# Altium project CU100_V1.0.PrjPCB
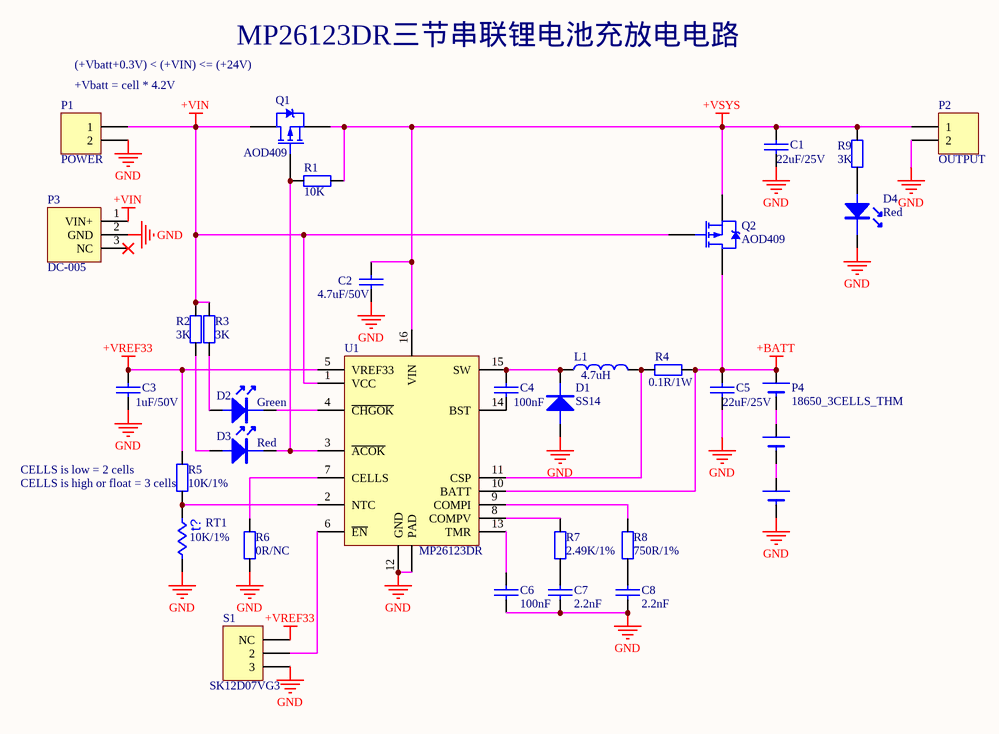
[diagram p0: CU100_V1.0.SchDoc]
1 sheet, 31 parts. Net scope: global (net labels, ports and power ports of the same name join across sheets).
Board files: CU100_V1.0.PcbDoc, CU100_Weld_V1.0.PcbDoc

## Sheet CU100_V1.0.SchDoc
size A4

### Parts
C1  22uF/25V  [1210_C]
C2  4.7uF/50V  [1206_C]
C3  1uF/50V  [0603_CN]
C4  100nF  [0603_CN]
C5  22uF/25V  [1210_C]
C6  100nF  [0603_CN]
C7  2.2nF  [0603_CN]
C8  2.2nF  [0603_CN]
D1  SS14  [DO-214AC(SMA)]
D2  Green  [0603_LED]
D3  Red  [0603_LED]
D4  Red  [0603_LED]
L1  4.7uH  [CDRH104]
P1  POWER  [KF5.08-2P]
P2  OUTPUT  [KF5.08-2P]
P3  DC-005  [DC-5.5-2.1mm]
P4  18650_3CELLS_THM  [18650_3CELLS_THM]
Q1  AOD409  [TO-252]
Q2  AOD409  [TO-252]
R1  10K  [0603_RN]
R2  3K  [0603_RN]
R3  3K  [0603_RN]
R4  0.1R/1W  [2512_R]
R5  10K/1%  [0603_RN]
R6  0R/NC  [0603_RN]
R7  2.49K/1%  [0603_RN]
R8  750R/1%  [0603_RN]
R9  3K  [0603_RN]
RT1  10K/1%  [RT3950K]
S1  SK12D07VG3  [SK12D07VG3]
U1  MP26123DR  [QFN16(4X4)]

### Nets
+BATT: C5.1 P4.1(+) Q2.2(D) R4.2 U1.10(BATT)
+VIN: P1.1 P3.1(VIN+) Q1.2(D) Q2.1(G) R2.1 R3.2 U1.1(VCC)
+VREF33: C3.1 R5.2 S1.1(NC) U1.5(VREF33)
+VSYS: C1.1 C2.1 P2.1 Q1.3(S) Q2.3(S) R1.2 R9.1 U1.16(VIN)
GND: C1.2 C2.2 C3.2 C5.2 C6.2 C7.2 C8.2 D1.A D4.K P1.2 P2.2 P3.2(GND) P4.6(-) R6.1 RT1.2 S1.3 U1.12(GND) U1.PAD
NetC4_1: C4.1 D1.K L1.1 U1.15(SW)
NetC4_2: C4.2 U1.14(BST)
NetC6_1: C6.1 U1.13(TMR)
NetC7_1: C7.1 R7.1
NetC8_1: C8.1 R8.1
NetD2_A: D2.A R3.1
NetD2_K: D2.K U1.4(~{CHGOK})
NetD3_A: D3.A R2.2
NetD3_K: D3.K Q1.1(G) R1.1 U1.3(~{ACOK})
NetD4_A: D4.A R9.2
NetL1_2: L1.2 R4.1 U1.11(CSP)
NetP4_2: P4.2(-) P4.3(+)
NetP4_4: P4.4(-) P4.5(+)
NetR5_1: R5.1 RT1.1 U1.2(NTC)
NetR6_2: R6.2 U1.7(CELLS)
NetR7_2: R7.2 U1.8(COMPV)
NetR8_2: R8.2 U1.9(COMPI)
NetS1_2: S1.2 U1.6(~{EN})

Not connected (* = marked no-connect by the designer): P3 3(NC)*

### Notes on the sheet
- MP26123DR三节串联锂电池充放电电路
- (+Vbatt+0.3V) < (+VIN) <= (+24V)
- (near P1) +Vbatt = cell * 4.2V
- (near R5) CELLS is low = 2 cells
- (near R5) CELLS is high or float = 3 cells
- (in symbol RT) t?

### Library data of the parts
C1-C8 = Cap1
D1 = Diode-A: SS14,SS24,SS34,M7
D2-D4 = LED
L1 = Inductor: LQH1206: L=3.2mm,W=1.6mm,H=1.8mm; LQH2220: L=5.7mm,W=5mm,H=4.7mm; LQH1812: L=4.5mm,W=3.2mm,H=2.6mm; LQH1210: L=3.2mm,W=2.5mm,H=2mm; SMD1054: L=10mm,W=9mm,H=5.4mm; SMD5845: L=5.8mm,W=5.2mm,H=4.5mm; SMD7850: L=7.8mm,W=7mm,H=5mm; SMD1040: L=10mm,W=9mm,H=4mm; CDRH104: L=10mm,W=10mm,H=4.2mm; CDRH127: L=12mm,W=12mm,H=8mm; CDRH124: L=12mm,W=12mm,H=5mm; SMD7835: L=7.8mm,W=7mm,H=3.5mm; SMD3521: L=3.5mm,W=3.1mm,H=2.1mm; SMD4532: L=4.5mm,W=4mm,H=3.2mm; CDRH125: L=12mm,W=12mm,H=6.2mm; Inductance-8*10: D=8mm,H=10mm; Inductance-6*8: D=6mm,H=8mm; 0402_L: *; 1206_L: *; 0603_L: *; 1210_L: *; 0805_L: *
P1 P2 = Header 2: Header, 2-Pin; LatestRevisionDate: 17-Jul-2002; LatestRevisionNote: Re-released for DXP Platform.; Publisher: Altium Limited
R1-R9 = Res1: Name: Resistor; Power: 0210(1/20W 25V), 0402(1/16W  50V),0603(1/16W  50V),0805(1/10W  150V),1206(1/8W  200V),1210(1/4W  200V),1812(1/2W  200V),2010(1/2W  200V),2512(1W  200V),
RT1 = RT: Thermistor; Published: 24-Mar-1999; LatestRevisionDate: 04-Mar-2005; LatestRevisionNote: PCB Footprint replaced.; PackageReference: 6-0805; Publisher: Altium Limited